# EAGLE schematic Counter2DigitSF (EAGLE 6.4)
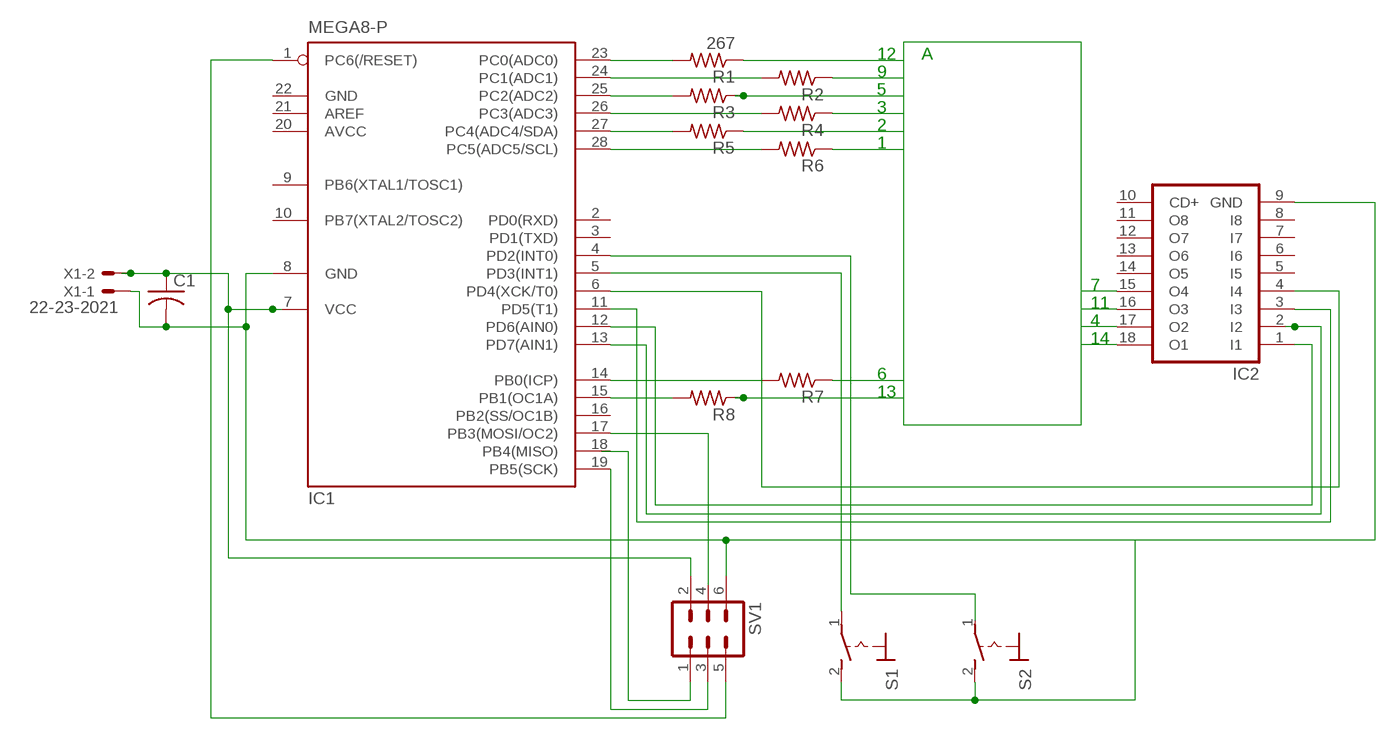
[diagram p0: schematic, sheet 1]

## Parts
C1  C-USC0805  [C0805]
IC1  MEGA8-P  [DIL28-3]
IC2  ULN2803A  [DIL18]
R1  267  R-US_M0805  [M0805]
R2  R-US_M0805  [M0805]
R3  R-US_M0805  [M0805]
R4  R-US_M0805  [M0805]
R5  R-US_M0805  [M0805]
R6  R-US_M0805  [M0805]
R7  R-US_M0805  [M0805]
R8  R-US_M0805  [M0805]
S1  MS243  [MS243]
S2  MS243  [MS243]
SV1  MA03-2  [MA03-2]
X1  22-23-2021  [22-23-2021]

## Nets
N$1: C1.1 IC1.7(VCC) SV1.2 X1.2
N$2: C1.2 IC1.8(GND) IC2.9(GND) S1.2(S) S2.2(S) SV1.6 X1.1
N$3: IC1.23(PC0(ADC0)) R1.2
N$4: IC1.24(PC1(ADC1)) R2.2
N$5: IC1.25(PC2(ADC2)) R3.2
N$6: IC1.26(PC3(ADC3)) R4.2
N$7: IC1.27(PC4(ADC4/SDA)) R5.2
N$8: IC1.28(PC5(ADC5/SCL)) R6.2
N$9: IC1.14(PB0(ICP)) R7.2
N$10: IC1.15(PB1(OC1A)) R8.2
N$11: IC2.15(O4) IC2.16(O3) IC2.17(O2) IC2.18(O1) R1.1 R2.1 R3.1 R5.1 R6.1 R7.1 R8.1
N$12: R4.1
N$13: IC1.12(PD6(AIN0)) IC2.1(I1)
N$14: IC1.13(PD7(AIN1)) IC2.2(I2)
N$15: IC1.11(PD5(T1)) IC2.3(I3)
N$16: IC1.6(PD4(XCK/T0)) IC2.4(I4)
N$17: SV1.1
N$18: IC1.19(PB5(SCK)) SV1.3
N$19: IC1.17(PB3(MOSI/OC2))
N$20: IC1.1(PC6(/RESET)) SV1.5
N$21: IC1.5(PD3(INT1)) S1.1(P)
N$22: IC1.4(PD2(INT0))
Unconnected: IC1.2(PD0(RXD)) IC1.3(PD1(TXD)) IC1.9(PB6(XTAL1/TOSC1)) IC1.10(PB7(XTAL2/TOSC2)) IC1.16(PB2(SS/OC1B)) IC1.18(PB4(MISO)) IC1.21(AREF) IC2.5(I5) IC2.6(I6) IC2.7(I7) IC2.8(I8) IC2.10(CD+) IC2.11(O8) IC2.12(O7) IC2.13(O6) IC2.14(O5) S2.1(P) SV1.4

## Notes on the sheet
- 12 | A
- 9
- 5
- 3
- 2
- 1
- 7
- 11
- 4
- 14
- 6
- 13

## Power pins joined to a net without a drawn wire
AVCC: IC1.20(AVCC)
GND: IC1.22(GND)

## Library data of the parts
C1 = rcl:C-US: CAPACITOR, American symbol
IC1 = atmel:MEGA8-P: MICROCONTROLLER 8 Kbytes FLASH, 1 kbytes SRAM, 512 bytes EEPROM, USART, 4-channel 10 bit ADC, 2-channel 8 bit ADC Pin compatible with Atmega48, ATMega88, ATMega168 Source: avr.lbr; OC_FARNELL: unknown; OC_NEWARK: unknown
IC2 = uln-udn:ULN2803A: DRIVER ARRAY
R1-R8 = rcl:R-US_: RESISTOR, American symbol
S1 S2 = switch:MS243: TOGGLE SWITCH
SV1 = con-lstb:MA03-2: PIN HEADER; OC_FARNELL: unknown; OC_NEWARK: unknown
X1 = con-molex:22-23-2021: .100" (2.54mm) Center Header - 2 Pin; MF: MOLEX; MPN: 22-23-2021; OC_FARNELL: 1462926; OC_NEWARK: 25C3832